# EAGLE design core (EAGLE 6.3)
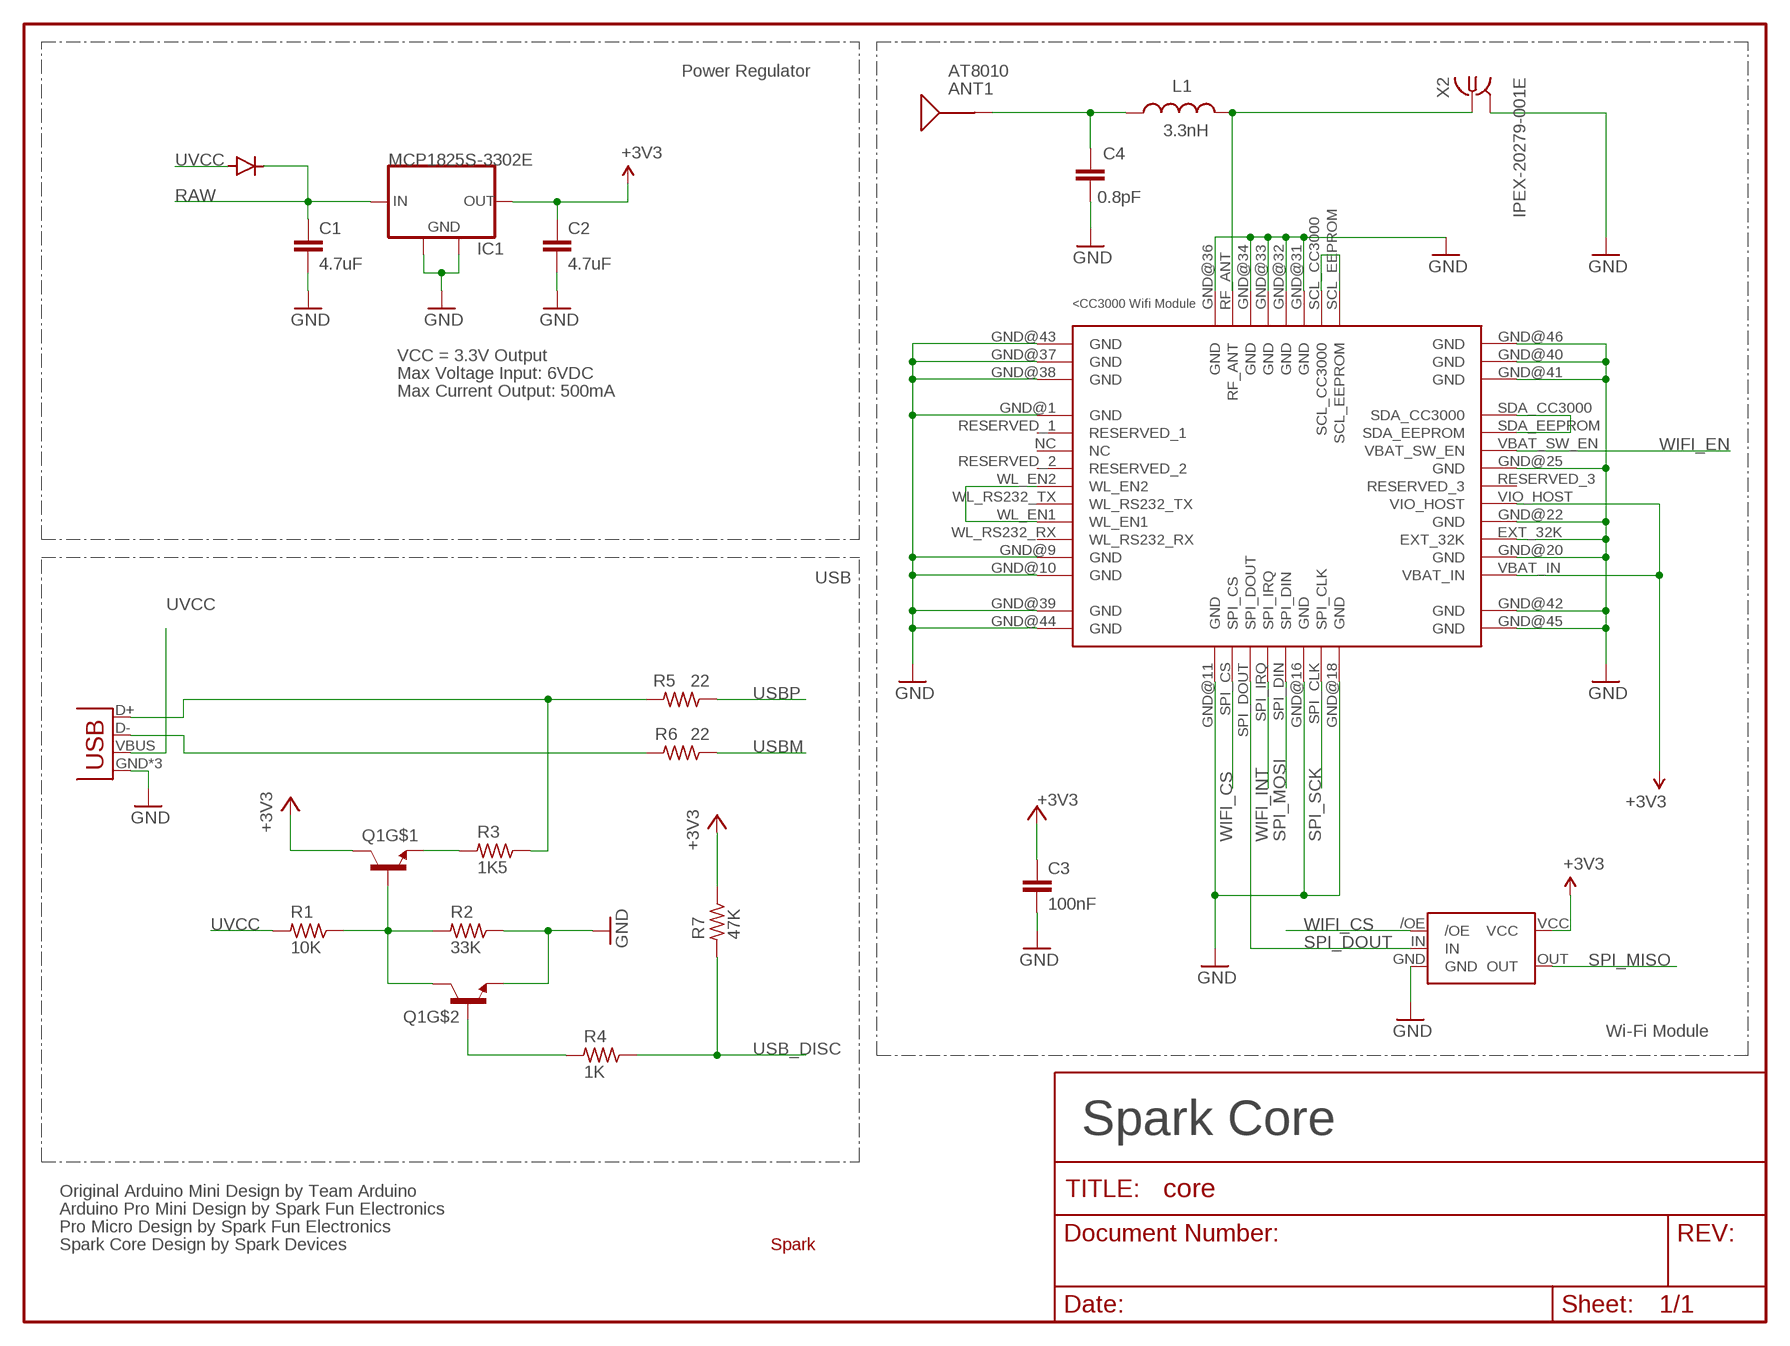
[diagram p0: schematic, sheet 1, part 1 of 2]
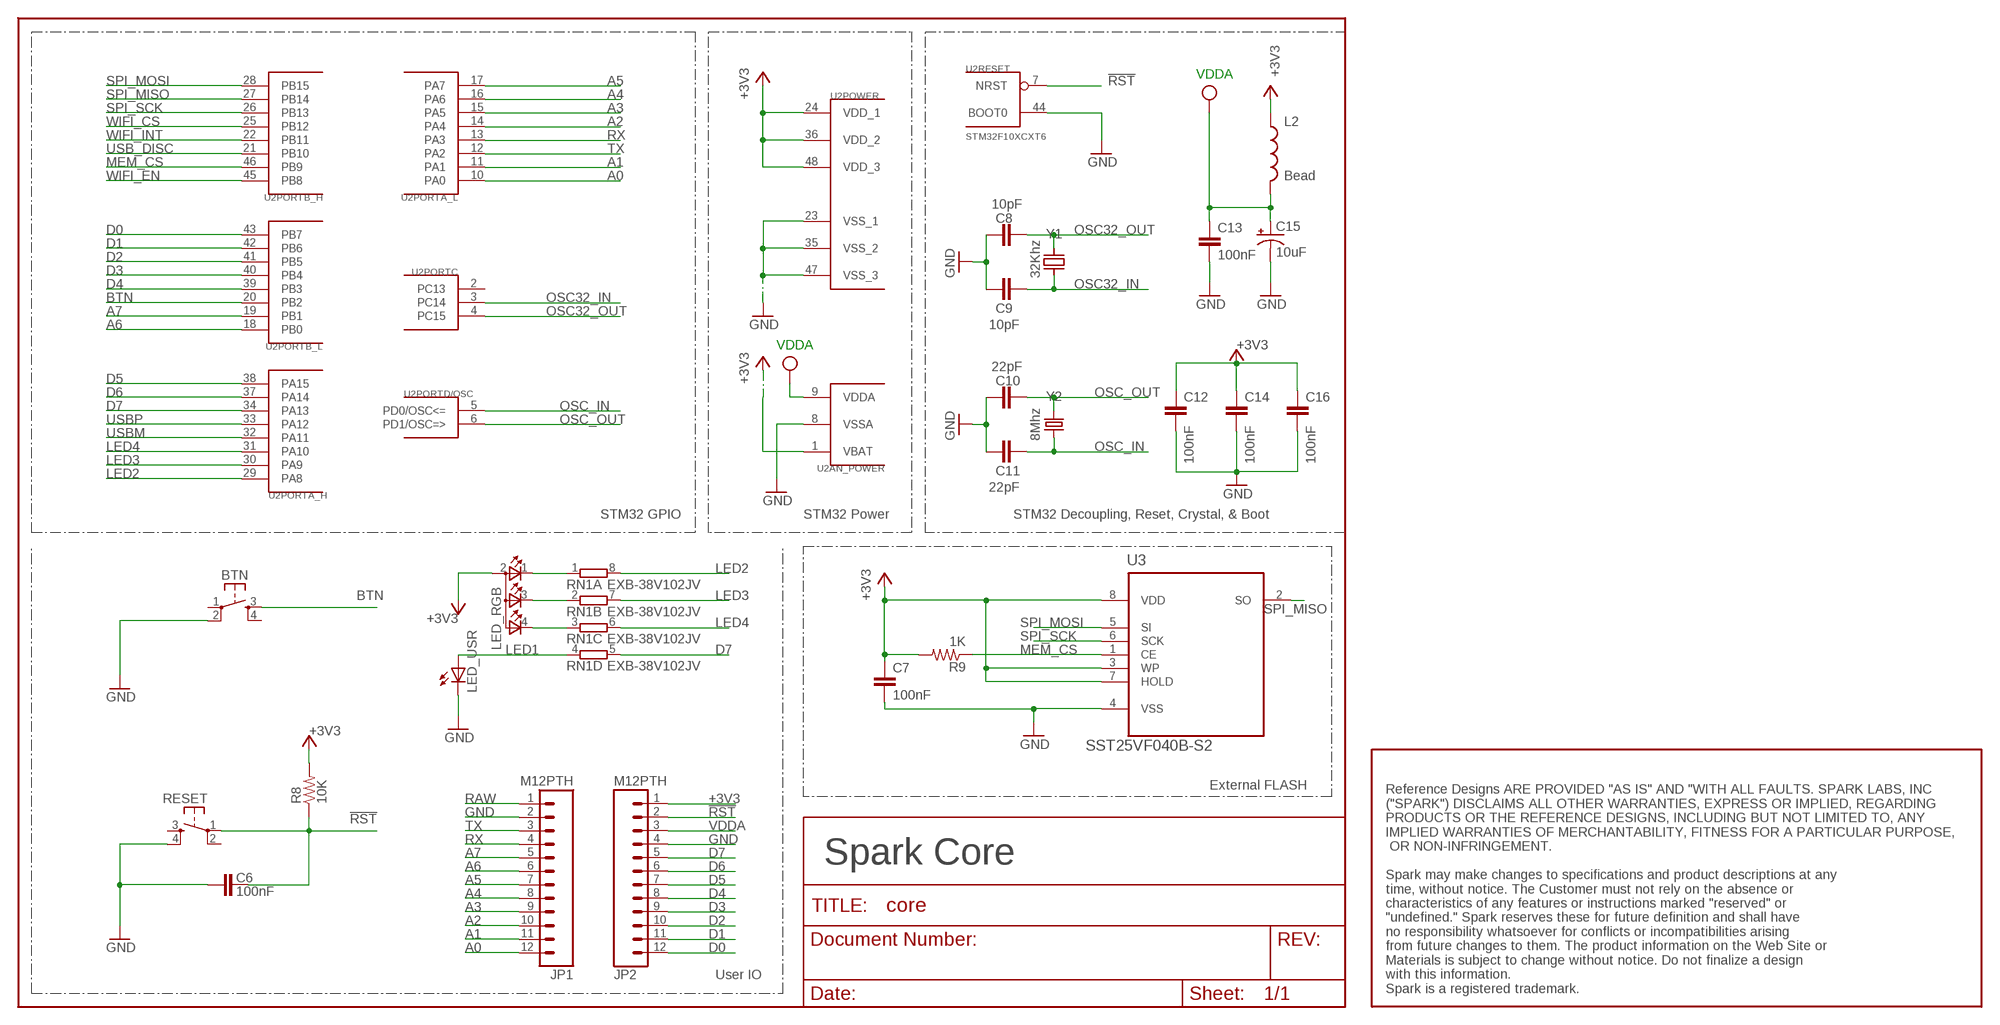
[diagram p1: schematic, sheet 1, part 2 of 2]

## Parts
ANT1  AT8010  [AT8010]
BTN  KMR211GLFS  TAC_SWITCHSMD  [TACTILE_SWITCH_SMD]
C1  4.7uF  C-EUC0603  [C0603]
C2  4.7uF  C-EUC0603  [C0603]
C3  100nF  C-EUC0603  [C0603]
C4  0.8pF  C-EUC0603  [C0603]
C6  100nF  C-EUC0603  [C0603]
C7  100nF  C-EUC0603  [C0603]
C8  10pF  C-EUC0603  [C0603]
C9  10pF  C-EUC0603  [C0603]
C10  22pF  C-EUC0603  [C0603]
C11  22pF  C-EUC0603  [C0603]
C12  100nF  C-EUC0603  [C0603]
C13  100nF  C-EUC0603  [C0603]
C14  100nF  C-EUC0603  [C0603]
C15  10uF  TANT-CAP1206  [EIA3216]
C16  100nF  C-EUC0603  [C0603]
D1  DIODE  [DIODE-DO-220AA(SMP)]
IC1  MCP1825S-3302E  MCP1825S-SOT223  [SOT223]
JP1  M12PTH  [1X12-SMALL-PADS]
JP2  M12PTH  [1X12-SMALL-PADS]
L1  3.3nH  INDUCTOR0603  [0603]
L2  Bead  INDUCTOR0603  [0603]
LED_RGB  TOPLED-3PLCC  [P-LCC-4-3]
LED_USR  LED0603  [LED-0603]
Q1  MMDT3904  [SOT363]
R1  10K  R-US_R0603  [R0603]
R2  33K  R-US_R0603  [R0603]
R3  1K5  R-US_R0603  [R0603]
R4  1K  R-US_R0603  [R0603]
R5  22  R-US_R0603  [R0603]
R6  22  R-US_R0603  [R0603]
R7  47K  R-US_R0603  [R0603]
R8  10K  R-US_R0603  [R0603]
R9  1K  R-US_R0603  [R0603]
RESET  KMR211GLFS  TAC_SWITCHSMD  [TACTILE_SWITCH_SMD]
RN1  EXB-38V102JV  4R-NEXB38V  [EXB38V]
U1  CC3000  [CC3000]
U2  STM32F10XCXT6  [TQFP48]
U3  SST25VF040B-S2  [SOIC127P790X216-8N]
U4  NL17SZ125SOT553  [SOT-553]
U$1  SPARK_LOGO2  [SPARK_LOGO2]
X1  USB-MICROB  USBUSB-MICROB-SLOT-HOLE  [USB-MICROB-SLOT-HOLE]
X2  IPEX-20279-001E  [IPEX-20279-001E]
Y1  32Khz  Q_FC135  [FC135]
Y2  8Mhz  CRYSTAL5X3  [CRYSTAL-SMD-5X3]

## Nets
!RST: C6.2 JP2.2 R8.1 RESET.1 U2.7(RESET:NRST)
+3V3: C2.1 C3.1 C7.1 C12.1 C14.1 C16.1 IC1.3(OUT) JP2.1 L2.1 LED_RGB.2(A2) Q1.3(C) R7.1 R8.2 R9.2 U1.VBAT_IN U1.VIO_HOST U2.1(AN_POWER:VBAT) U2.24(POWER:VDD_1) U2.36(POWER:VDD_2) U2.48(POWER:VDD_3) U3.3(WP) U3.7(HOLD) U3.8(VDD) U4.VCC
A0: JP1.12 U2.10(PORTA_L:PA0)
A1: JP1.11 U2.11(PORTA_L:PA1)
A2: JP1.10 U2.14(PORTA_L:PA4)
A3: JP1.9 U2.15(PORTA_L:PA5)
A4: JP1.8 U2.16(PORTA_L:PA6)
A5: JP1.7 U2.17(PORTA_L:PA7)
A6: JP1.6 U2.18(PORTB_L:PB0)
A7: JP1.5 U2.19(PORTB_L:PB1)
BTN: BTN.3 U2.20(PORTB_L:PB2)
D0: JP2.12 U2.43(PORTB_L:PB7)
D1: JP2.11 U2.42(PORTB_L:PB6)
D2: JP2.10 U2.41(PORTB_L:PB5)
D3: JP2.9 U2.40(PORTB_L:PB4)
D4: JP2.8 U2.39(PORTB_L:PB3)
D5: JP2.7 U2.38(PORTA_H:PA15)
D6: JP2.6 U2.37(PORTA_H:PA14)
D7: JP2.5 RN1.5 U2.34(PORTA_H:PA13)
GND [vcc]: BTN.2 C1.2 C2.2 C3.2 C4.2 C6.1 C7.2 C8.2 C9.2 C10.2 C11.2 C12.2 C13.2 C14.2 C15.C(-) C16.2 IC1.2(GND) IC1.4(GND) JP1.2 JP2.4 LED_USR.C Q1.1(E) R2.1 RESET.4 U1.EXT_32K U1.GND@1(GND) U1.GND@9(GND) U1.GND@10(GND) U1.GND@11(GND) U1.GND@16(GND) U1.GND@18(GND) U1.GND@20(GND) U1.GND@22(GND) U1.GND@25(GND) U1.GND@31(GND) U1.GND@32(GND) U1.GND@33(GND) U1.GND@34(GND) U1.GND@36(GND) U1.GND@37(GND) U1.GND@38(GND) U1.GND@39(GND) U1.GND@40(GND) U1.GND@41(GND) U1.GND@42(GND) U1.GND@43(GND) U1.GND@44(GND) U1.GND@45(GND) U1.GND@46(GND) U2.8(AN_POWER:VSSA) U2.23(POWER:VSS_1) U2.35(POWER:VSS_2) U2.44(RESET:BOOT0) U2.47(POWER:VSS_3) U3.4(VSS) U4.GND X1.GND X1.MT1(GND) X1.MT2(GND) X2.2@1(GND) X2.2@2(GND)
LED1: LED_USR.A RN1.4
LED2: RN1.8 U2.29(PORTA_H:PA8)
LED3: RN1.7 U2.30(PORTA_H:PA9)
LED4: RN1.6 U2.31(PORTA_H:PA10)
MEM_CS: R9.1 U2.46(PORTB_H:PB9) U3.1(CE)
N$1: R3.1 R5.2 X1.D+
N$2 [RF]: L1.2 U1.RF_ANT X2.1
N$3 [RF]: ANT1.SIG(SIGNAL) C4.1 L1.1
N$6: R6.2 X1.D-
N$7: U1.SCL_CC3000 U1.SCL_EEPROM
N$8: Q1.2(B) R4.2
N$9: U1.WL_EN1 U1.WL_EN2
N$10: LED_RGB.1(CRED) RN1.1
N$12: LED_RGB.3(CBLUE) RN1.2
N$13: Q1.5(B) Q1.6(C) R1.1 R2.2
N$14: LED_RGB.4(CGREEN) RN1.3
N$15: U1.SDA_CC3000 U1.SDA_EEPROM
N$16: Q1.4(E) R3.2
OSC32_IN: C9.1 U2.3(PORTC:PC14) Y1.X1
OSC32_OUT: C8.1 U2.4(PORTC:PC15) Y1.X2
OSC_IN: C11.1 U2.5(PORTD/OSC:PD0/OSC<=) Y2.1
OSC_OUT: C10.1 U2.6(PORTD/OSC:PD1/OSC=>) Y2.3
RAW [vcc]: C1.1 D1.CATHODE IC1.1(IN) JP1.1
RX: JP1.4 U2.13(PORTA_L:PA3)
SPI_DOUT: U1.SPI_DOUT U4.IN
SPI_MISO: U2.27(PORTB_H:PB14) U3.2(SO) U4.OUT
SPI_MOSI: U1.SPI_DIN U2.28(PORTB_H:PB15) U3.5(SI)
SPI_SCK: U1.SPI_CLK U2.26(PORTB_H:PB13) U3.6(SCK)
TX: JP1.3 U2.12(PORTA_L:PA2)
USB_DISC: R4.1 R7.2 U2.21(PORTB_H:PB10)
USBM: R6.1 U2.32(PORTA_H:PA11)
USBP: R5.1 U2.33(PORTA_H:PA12)
UVCC: D1.ANODE R1.2 X1.VBUS
VDDA: C13.1 C15.A(+) JP2.3 L2.2 U2.9(AN_POWER:VDDA) ; supply symbol labelled VCC
WIFI_CS: U1.SPI_CS U2.25(PORTB_H:PB12) U4./OE
WIFI_EN: U1.VBAT_SW_EN U2.45(PORTB_H:PB8)
WIFI_INT: U1.SPI_IRQ U2.22(PORTB_H:PB11)
Unconnected: BTN.1 BTN.4 RESET.2 RESET.3 U1.NC U1.RESERVED_1 U1.RESERVED_2 U1.RESERVED_3 U1.WL_RS232_RX U1.WL_RS232_TX U2.2(PORTC:PC13)

## Notes on the sheet
- Power Regulator
- VDDA
- VCC = 3.3V Output
- Max Voltage Input: 6VDC
- Max Current Output: 500mA
- VDDA
- USB
- STM32 GPIO | STM32 Power | STM32 Decoupling, Reset, Crystal, & Boot
- Wi-Fi Module | External FLASH
- Spark Core | Spark Core
- Original Arduino Mini Design by Team Arduino
- Arduino Pro Mini Design by Spark Fun Electronics
- Pro Micro Design by Spark Fun Electronics
- Spark Core Design by Spark Devices
- User IO
- Reference Designs ARE PROVIDED "AS IS" AND "WITH ALL FAULTS. SPARK LABS, INC 
  ("SPARK") DISCLAIMS ALL OTHER WARRANTIES, EXPRESS OR IMPLIED, REGARDING 
  PRODUCTS OR THE REFERENCE DESIGNS, INCLUDING BUT NOT LIMITED TO, ANY 
  IMPLIED WARRANTIES OF MERCHANTABILITY, FITNESS FOR A PARTICULAR PURPOSE,
   OR NON-INFRINGEMENT.
  
  Spark may make changes to specifications and product descriptions at any 
  time, without notice. The Customer must not rely on the absence or 
  characteristics of any features or instructions marked "reserved" or 
  "undefined." Spark reserves these for future definition and shall have 
  no responsibility whatsoever for conflicts or incompatibilities arising 
  from future changes to them. The product information on the Web Site or 
  Materials is subject to change without notice. Do not finalize a design 
  with this information. 
  Spark is a registered trademark.

## Library data of the parts
ANT1 = Spark:AT8010: AT8010 Series Multilayer Chip Antenna
BTN RESET = Spark:TAC_SWITCH: SMD Tactiile Switch
C1-C4 C6-C14 C16 = rcl:C-EU: CAPACITOR, European symbol
C15 = Spark:TANT-CAP: Tantalum SMT
D1 = Spark:DIODE
IC1 = Spark:MCP1825S: 500 mA, Low Voltage, Low Quiescent Current LDO Regulator
JP1 JP2 = Spark:M12: Header 12 Standard 12-pin 0.1" header. Use with straight break away headers (SKU : PRT-00116), right angle break away headers (PRT-00553), swiss pins (PRT-00743), machine pins (PRT-00117), and female headers (PRT-00115).
L1 L2 = SparkFun-Passives:INDUCTOR: Inductors Basic Inductor/Choke - 0603 and 1206. Footprints are not proven and vary greatly between part numbers.
LED_RGB = Spark:TOPLED-3: Cree CLVBA-FKA
LED_USR = SparkFun:LED: LEDs Standard schematic elements and footprints for 5mm, 3mm, 1206, and 0603 sized LEDs. 5mm - Spark Fun Electronics SKU : COM-00529 (and others)
Q1 = SparkFun-DiscreteSemi:MMDT3904: Dual NPN transistor
R1-R9 = rcl:R-US_: RESISTOR, American symbol
RN1 = resistor-dil:4R-N: Array Chip Resistor Source: RS Component / Phycomp; OC_FARNELL: unknown; OC_NEWARK: unknown
U1 = CC3000:CC3000
U2 = stm32:STM32F10XCXT6: ST STM32F101/103 48pin LQFP
U3 = Spark:SST25VF040B: 4 Mbit SPI Serial Flash
U4 = Spark:NL17SZ125
U$1 = Spark:SPARK_LOGO2
X1 = Spark:USB
X2 = Spark:IPEX-20279-001E: Ultra Miniature Coaxial SMT RF Receptacle
Y1 = Spark:Q
Y2 = SparkFun-FreqCtrl:CRYSTAL: Various standard crystals. Proven footprints. Spark Fun Electronics SKU : COM-00534

## Net classes
2 RF: width 0.635 mm, clearance 0.762 mm

## Board
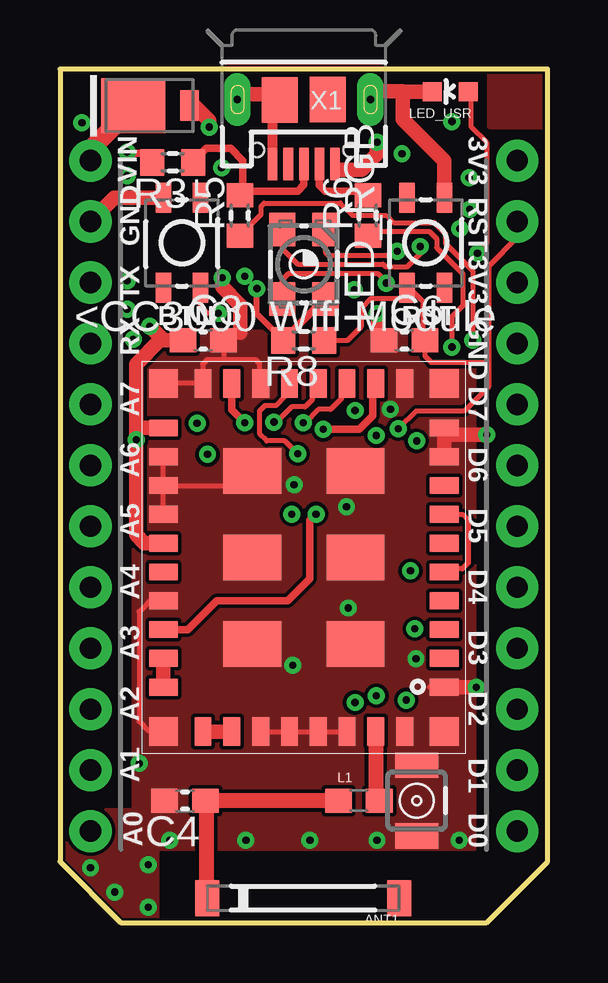
[diagram p2: board, top side]
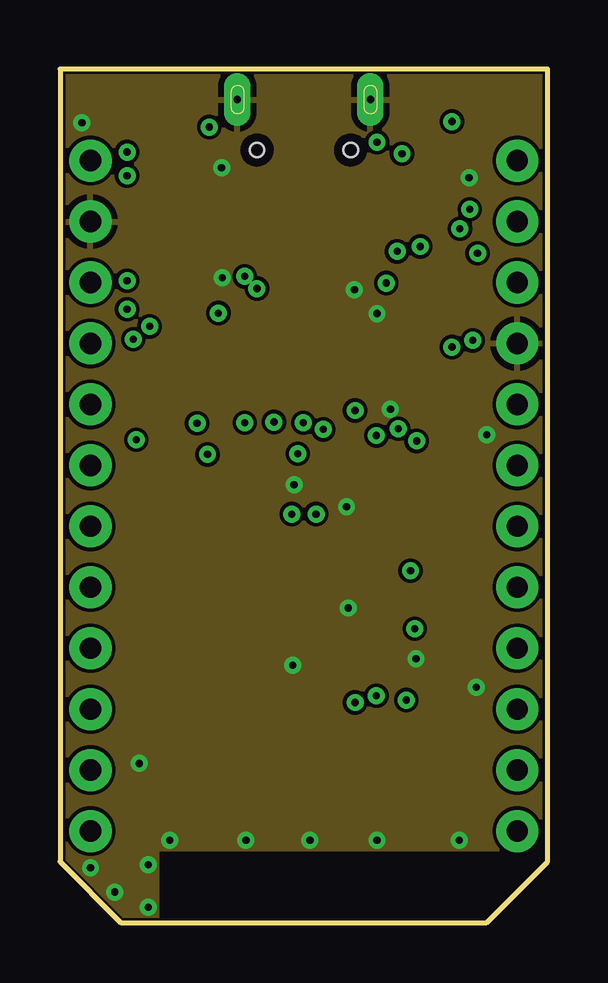
[diagram p3: board, inner layer $GND]
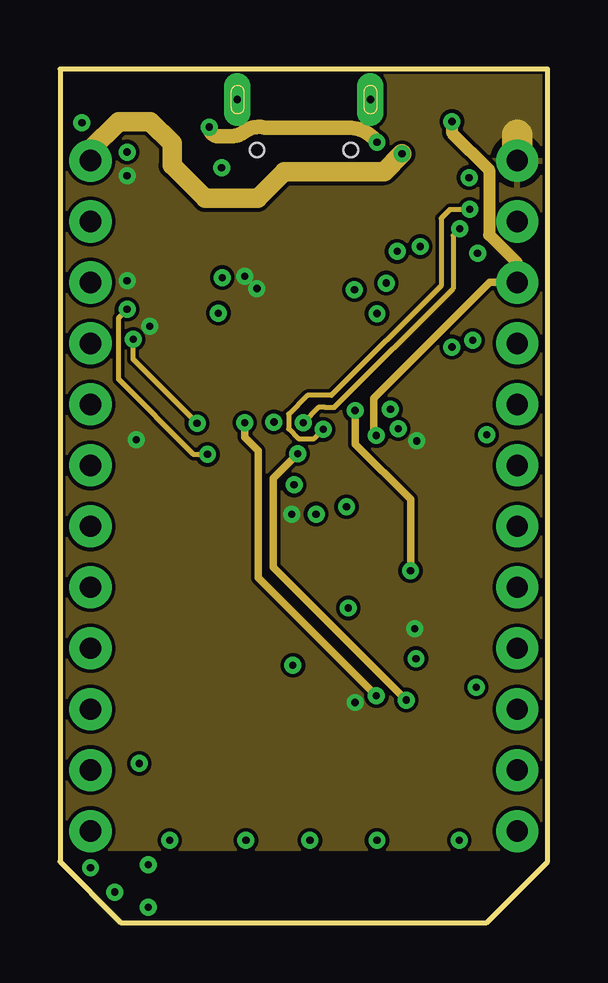
[diagram p4: board, inner layer $+3V3]
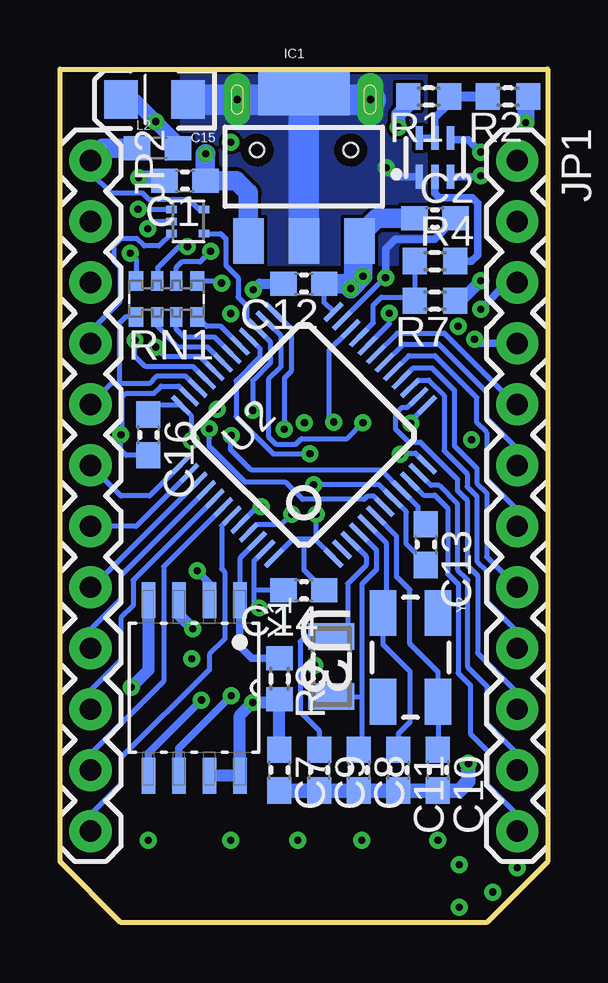
[diagram p5: board, bottom side, seen from below]

Size 20.32 x 35.56 mm. Coordinates in mm from the lower left corner, seen from the top.
Outline: 0,35.56 0,2.54 2.54,0 17.78,0 20.32,2.54 20.32,35.56 0,35.56
Copper layers (1+2*15+16): Top 0.035mm / dielectric 1.5mm / $GND 0.035mm / dielectric 0.15mm / $+3V3 0.035mm / dielectric 0.2mm / Bottom 0.035mm
Design rules "spark *": minimum track width 6mil, minimum drill 0.3mm, track to track 6mil, track to pad 6mil, pad to pad 6mil, via to via 6mil, smd to smd 6mil, copper to edge 4mil, drill to drill 6mil, minimum pad ring 12mil, minimum via ring 8mil, stop-mask expansion 4mil, vias tented up to drill 20mil, thermal gap 10mil

### Footprints (pad centres in the part's own frame; a part is rotated, then mirrored left to right if it is on the bottom)
AT8010 = smd 1 x 1.5: NC -4,0; SIG 4,0
TACTILE_SWITCH_SMD = smd 1.25 x 0.65: 1 -1.875,0.775; 2 1.875,0.775; 3 -1.875,-0.775; 4 1.875,-0.775
C0603 = smd 1.1 x 1: 1 -0.85,0; 2 0.85,0
EIA3216 = smd 1.4 x 1.6: A 1.4,0; C -1.4,0
DIODE-DO-220AA(SMP) = smd 0.762 x 1.27: ANODE 2.349,0 | smd 2.667 x 2.286: CATHODE 0,0
SOT223 = smd 1.27 x 1.905: 1 -2.311,-3.099; 2 0,-3.099; 3 2.311,-3.099 | smd 3.81 x 1.905: 4 0,3.099
1X12-SMALL-PADS = drill 0.889 pad 1.753: 1 0,0; 2 2.54,0; 3 5.08,0; 4 7.62,0; 5 10.16,0; 6 12.7,0; 7 15.24,0; 8 17.78,0; 9 20.32,0; 10 22.86,0; 11 25.4,0; 12 27.94,0
0603 = smd 1.1 x 1: 1 -0.85,0; 2 0.85,0
P-LCC-4-3 = smd 1.1 x 1.4: 1 -0.9,-1.45; 2 0.9,-1.45; 3 0.9,1.45; 4 -0.9,1.45
LED-0603 = smd 0.8 x 0.8: A 0,-0.75; C 0,0.75
SOT363 = smd 0.3 x 0.99: 1 -0.65,-0.8; 2 0,-0.8; 3 0.65,-0.8; 4 0.65,0.81; 5 0,0.81; 6 -0.65,0.81
R0603 = smd 1 x 1.1: 1 -0.85,0; 2 0.85,0
EXB38V = smd 0.6 x 0.8: 1 -1.275,-0.75; 4 1.275,-0.75; 5 1.275,0.75; 8 -1.275,0.75 | smd 0.5 x 0.8: 2 -0.4,-0.75; 3 0.4,-0.75; 6 0.4,0.75; 7 -0.4,0.75
CC3000 = smd 1.2 x 0.7: EXT_32K 5.85,-2.97; GND@1 -5.85,5.43; GND@9 -5.85,-4.17; GND@10 -5.85,-5.37; GND@20 5.85,-4.17; GND@22 5.85,-1.77; GND@25 5.85,1.83; NC -5.85,3.03; RESERVED_1 -5.85,4.23; RESERVED_2 -5.85,1.83; RESERVED_3 5.85,0.63; SDA_CC3000 5.85,5.43; SDA_EEPROM 5.85,4.23; VBAT_IN 5.85,-5.37; VBAT_SW_EN 5.85,3.03; VIO_HOST 5.85,-0.57; WL_EN1 -5.85,-1.77; WL_EN2 -5.85,0.63; WL_RS232_RX -5.85,-2.97; WL_RS232_TX -5.85,-0.57 | smd 0.7 x 1.2: GND@11 -4.2,-7.22; GND@16 1.8,-7.22; GND@18 4.2,-7.22; GND@31 1.8,7.28; GND@32 0.6,7.28; GND@33 -0.6,7.28; GND@34 -1.8,7.28; GND@36 -4.2,7.28; RF_ANT -3,7.28; SCL_CC3000 3,7.28; SCL_EEPROM 4.2,7.28; SPI_CLK 3,-7.22; SPI_CS -3,-7.22; SPI_DIN 0.6,-7.22; SPI_DOUT -1.8,-7.22; SPI_IRQ -0.6,-7.22 | smd 2.4 x 1.9: GND@37 -2.15,3.63; GND@38 -2.15,0.03; GND@39 -2.15,-3.57; GND@40 2.15,3.63; GND@41 2.15,0.03; GND@42 2.15,-3.57 | smd 1.2 x 1.2: GND@43 -5.85,7.28; GND@44 -5.85,-7.22; GND@45 5.85,-7.22; GND@46 5.85,7.28
TQFP48 = smd 0.2 x 1: 1 -2.75,-4.5; 2 -2.25,-4.5; 3 -1.75,-4.5; 4 -1.25,-4.5; 5 -0.75,-4.5; 6 -0.25,-4.5; 7 0.25,-4.5; 8 0.75,-4.5; 9 1.25,-4.5; 10 1.75,-4.5; 11 2.25,-4.5; 12 2.75,-4.5; 25 2.75,4.5; 26 2.25,4.5; 27 1.75,4.5; 28 1.25,4.5; 29 0.75,4.5; 30 0.25,4.5; 31 -0.25,4.5; 32 -0.75,4.5; 33 -1.25,4.5; 34 -1.75,4.5; 35 -2.25,4.5; 36 -2.75,4.5 | smd 1 x 0.2: 13 4.5,-2.75; 14 4.5,-2.25; 15 4.5,-1.75; 16 4.5,-1.25; 17 4.5,-0.75; 18 4.5,-0.25; 19 4.5,0.25; 20 4.5,0.75; 21 4.5,1.25; 22 4.5,1.75; 23 4.5,2.25; 24 4.5,2.75; 37 -4.5,2.75; 38 -4.5,2.25; 39 -4.5,1.75; 40 -4.5,1.25; 41 -4.5,0.75; 42 -4.5,0.25; 43 -4.5,-0.25; 44 -4.5,-0.75; 45 -4.5,-1.25; 46 -4.5,-1.75; 47 -4.5,-2.25; 48 -4.5,-2.75
SOIC127P790X216-8N = smd 1.499 x 0.559: 1 -3.658,1.905; 2 -3.658,0.635; 3 -3.658,-0.635; 4 -3.658,-1.905; 5 3.658,-1.905; 6 3.658,-0.635; 7 3.658,0.635; 8 3.658,1.905
SOT-553 = smd 0.3 x 0.45: /OE -0.5,0; GND 0.5,0; IN 0,0; OUT 0.5,1.35; VCC -0.5,1.35
USB-MICROB-SLOT-HOLE = smd 0.4 x 1.35: D+ 0,2.675; D- -0.65,2.675; GND 1.3,2.675; ID 0.65,2.675; VBUS -1.3,2.675 | drill 0.3 pad 1.1 long: MT1 -2.775,0; MT2 2.775,0 | smd 1.5 x 1.9: P$1 -1,0; P$2 1,0.01 | hole 0.6: -1.95,2.1; 1.95,2.1
IPEX-20279-001E = smd 1 x 1.05: 1 0,1.528 | smd 1.05 x 1.8: 2@1 -1.475,0; 2@2 1.475,0
FC135 = smd 1.1 x 1.9: X1 -1.25,0; X2 1.25,0
CRYSTAL-SMD-5X3 = smd 1.9 x 1.1: 1 -1.85,-1.15; 2 1.85,-1.15; 3 1.85,1.15; 4 -1.85,1.15

### Placement (x,y rotation side)
ANT1  10.13,1.02 180 top
BTN  5.08,28.32 90 top
C1  15.11,30.91 180 bottom
C2  4.7,29.34 0 bottom
C3  5.97,24.26 0 top
C4  5.21,5.08 180 top
C6  14.35,24.26 0 top
C7  11.18,6.35 270 bottom
C8  7.87,6.35 270 bottom
C9  9.53,6.35 270 bottom
C10  4.57,6.35 270 bottom
C11  6.22,6.35 270 bottom
C12  10.16,26.62 180 bottom
C13  5.08,15.75 270 bottom
C14  10.16,13.84 180 bottom
C15  16.38,34.29 180 bottom
C16  16.64,20.32 270 bottom
D1  3.05,34.04 0 top
IC1  10.16,31.5 0 bottom
JP1  1.27,31.75 270 bottom
JP2  19.05,31.75 270 bottom
L1  12.45,5.08 0 top
L2  16.26,32.26 0 bottom
LED_RGB  10.16,27.43 0 top
LED_USR  16.26,34.62 90 top
Q1  4.7,31.88 0 bottom
R1  4.95,34.42 180 bottom
R2  1.65,34.42 180 bottom
R3  4.7,31.67 180 top
R4  4.7,27.56 0 bottom
R5  7.49,29.46 90 top
R6  12.83,29.46 90 top
R7  4.7,25.91 180 bottom
R8  10.16,24.26 180 top
R9  11.18,10.16 270 bottom
RESET  15.24,28.32 90 top
RN1  15.88,25.98 180 bottom
U1  10.16,15.24 180 top
U2  10.16,20.32 45 bottom
U3  14.73,9.78 270 bottom
U4  15.67,29.21 270 bottom
U$1  17.78,33.02 0 top
X1  10.16,34.29 180 top
X2  14.86,5.08 90 top
Y1  9.02,10.67 270 bottom
Y2  5.71,11.05 270 bottom

### Tracks (layer width: path | path; a pad name or v marks a point on that pad's centre or on a via)
!RST  (via drill 0.3)
  Top 0.203: R8.1 11.99,24.26 12.55,24.82 12.55,25.6 12.95,26.01 14.46,26.01 RESET.1 14.55,26.45 15.14,25.86 15.14,24.32 C6.2 15.2,23.61 15.47,23.34 17.86,23.34 | v14.1,20.57 14.83,21.31 16.84,21.31 17.86,22.33 17.86,23.34 | JP2.2 19.05,28.55 17.86,27.36 17.86,23.34
  Bottom 0.203: 14.1,20.17 v14.1,20.57 14.1,19.84 12.6,18.34 10.92,18.34 10.21,17.63 7.64,17.63 7.49,17.78 7.27,17.78 U2.7
+3V3  (via drill 0.3)
  Top 0.254: R8.2 8.2,25.36 v8.2,26.42
  Top 0.305: R8.2 11.04,25.98 LED_RGB.2
  Top 0.61: U1.VIO_HOST 3.52,15.81 3.17,16.15 v3.17,20.12 3.17,20.62 | 3.17,20.62 3.17,23.27 4.17,24.26 4.32,24.26 | 4.32,24.26 C3.1 | U1.VBAT_IN 4.29,20.62 3.17,20.62 | v3.73,24.84 4.32,24.26
  $+3V3 1.27: JP2.1 19.05,32.82
  Bottom 0.203: U2.1 9.71,15.98 | 9.71,15.98 10.16,15.98 | 10.16,15.98 10.62,15.98 U2.48 | 10.16,15.98 10.16,14.69 C14.1 | C16.1 16.25,21.56 U2.36 14.86,21.13 v14.86,20.07 | 9.71,15.98 9.65,16.03 v9.65,17.02 | JP2.1 19.05,31.24 18.19,30.38 16.87,30.38 16.61,30.12 14.94,30.12 14.52,29.71 U4.VCC | U2.24 9.31,25.83 C12.1
  Bottom 0.305: Q1.3 2.83,31.08 arc-90 v2.79,31.11
  Bottom 0.508: U3.7 U3.8 12.83,8.64 v12.29,9.17 11.32,9.17 R9.2 C7.1 | v14.78,12.24 15.37,12.83 U3.3 | v2.79,26.75 3.63,25.91 R7.1
  Bottom 0.813: C2.1 7.11,29.34 7.85,28.6 IC1.3 7.85,27.08 v7.7,26.92 | L2.1 18.54,32.26 JP2.1 | v8.2,26.42 v7.7,26.92 | v7.7,26.92 7.7,28.83 8.08,28.45 8.08,26.62 C12.1
  pour $+3V3: 0,35.56 20.32,35.56 20.32,3.05 0,3.05
A0
  Bottom 0.203: U2.10 5.17,17.8 4.7,17.8 4.17,17.27 4.17,14.53 3.73,14.1 3.73,10.39 3.23,9.88 3.23,7.87 2.52,7.16 2.52,5.74 1.27,4.5 JP1.12
A1
  Bottom 0.203: U2.11 4.87,18.21 4.52,18.21 3.76,17.45 3.76,14.71 3.33,14.28 3.33,10.64 2.52,9.83 2.52,8.28 1.27,7.04 JP1.11
A2
  Bottom 0.203: JP1.10 1.27,9.58 2.92,11.23 2.92,14.45 3.35,14.88 3.35,17.6 3.76,18.01 3.76,18.47 5.31,20.02 5.79,20.02 6.35,20.57 6.35,21.18 6.07,21.46 5.84,21.46 U2.14
A3
  Bottom 0.203: U2.15 5.4,22.61 4.95,22.61 4.32,21.97 4.32,19.66 3.35,18.69 3.35,18.16 2.95,17.75 2.95,15.06 2.52,14.63 2.52,13.36 1.27,12.12 JP1.9
A4
  Bottom 0.203: U2.16 5.6,23.11 4.83,23.11 3.89,22.17 3.89,19.86 2.95,18.92 2.95,18.31 2.54,17.91 2.54,15.24 JP1.8
A5
  Bottom 0.203: U2.17 5.8,23.62 4.7,23.62 2.95,21.87 2.95,20.83 2.54,20.42 2.54,18.47 1.27,17.2 JP1.7
A6
  Bottom 0.203: U2.18 6.02,24.11 4.55,24.11 2.54,22.1 2.54,21.01 1.27,19.74 JP1.6
A7
  Bottom 0.203: U2.19 6.27,24.56 4.32,24.56 1.35,21.59 JP1.5
BTN  (via drill 0.3)
  Top 0.203: 5.84,26.43 BTN.3 5.87,26.43 5.87,25.65 6.13,25.39 v6.6,25.39
  Bottom 0.203: U2.20 6.6,24.94 v6.6,25.39
D0
  Bottom 0.203: JP2.12 19.05,4.5 17.78,5.77 17.78,6.86 14.1,10.54 14.1,11.18 13.46,11.81 13.46,14.61 13.59,14.73 13.59,16.54 U2.43
D1
  Bottom 0.203: U2.42 16,14.83 16,10.06 19.05,7.01 JP2.11
D2
  Bottom 0.203: U2.41 17.27,14.27 17.27,13.21 17.78,12.7 17.78,10.92 19.05,9.65 JP2.10
D3
  Bottom 0.203: U2.40 17.77,14.48 17.78,14.48 17.78,13.46 19.05,12.19 JP2.9
D4
  Bottom 0.203: U2.39 18.98,13.97 JP2.8
D5
  Bottom 0.203: U2.38 17.15,16.51 JP2.7
D6
  Bottom 0.203: U2.37 16.59,17.78 17.78,17.78 JP2.6
D7
  Bottom 0.203: 17.88,22.45 16.61,22.45 16.31,22.76 15.07,22.76 U2.34 | 17.88,22.45 18.19,22.45 JP2.5 | RN1.5 17.59,25.23 17.86,24.97 17.86,22.48 17.88,22.45
GND  (via drill 0.3)
  Top 0.203: U1.GND@43 16.01,8.12 | U1.GND@1 15.4,9.81 | U1.GND@34 U1.GND@33 U1.GND@32 U1.GND@31 8.36,8.4 | U1.GND@22 U1.EXT_32K | U1.GND@38 12.41,15.11 | U1.GND@25 4.49,13.59 3.94,13.59 3.3,12.95 3.3,8.38 3.68,8 4.27,8 U1.GND@46 | U1.EXT_32K U1.GND@20 | U1.EXT_32K 7.41,18.21 U1.GND@42 | 6.83,23.47 6.15,23.47 5.94,23.27 5.94,22.48 | 6.83,23.47 8.13,23.47 8.31,23.29 8.31,22.51 U1.GND@16 8.26,22.36 8.26,21.97 | C3.2 6.82,23.48 6.83,23.47 | U1.GND@18 5.94,22.48 | 5.94,22.48 4.33,22.48 U1.GND@45
  Top 0.406: X1.GND 8.86,34.51
  Top 0.508: v13.21,25.38 13.21,24.55 C6.1
  Top 0.61: U1.GND@1 v17.34,9.81 v17.35,9.8 | v6.76,26.87 6.76,26.49 7.52,25.73 7.52,24.57 | U1.GND@9 U1.GND@10 16.3,20.32 v17.78,20.32 | BTN.2 2.26,30.2 JP1.2 | 8.86,34.51 7.61,34.51 X1.MT2 | 14.28,34.65 13.29,34.65 X1.MT1 | RESET.4 16.02,31.74 14.28,33.48 14.28,34.65 | LED_USR.C 14.3,34.62 14.28,34.65
  $GND 0.406: X1.MT2 7.38,34.85 7.39,34.85 7.39,34.67 | X1.MT1 12.93,34.31 | 12.93,34.85 12.93,34.7
  $GND 1.016: 7.39,34.85 7.39,34.67 7.39,33.73 | 12.93,34.85 12.93,34.7 12.93,34.31 12.93,33.73
  $+3V3 0.406: 7.39,34.7 7.38,34.7 X1.MT2 | 12.93,34.7 12.94,34.7 X1.MT1
  $+3V3 0.813: 7.39,33.91 7.39,34.7 | 12.93,33.91 12.93,34.7
  Bottom 0.203: U2.35 15.37,22.35 16.1,22.35 16.41,22.05 17.58,22.05 17.73,21.89 17.73,20.37 v17.78,20.32 17.78,19.68 17.57,19.47 C16.2 | U2.47 12.24,15.05 12.24,13.84 | C13.2 5.08,14.96 5.89,15.77 5.89,17.11 U2.8 7.02,18.24 v9.75,18.24 | U4.GND 16.19,28.19 16.82,28.19 17.12,28.5 17.78,28.5 18.09,28.19 18.09,27.58 17.83,27.33 17.83,25.86 19.05,24.64 JP2.4 | U2.44 12.1,17.32 v11.94,17.32 | 12.24,13.84 12.24,13.34 v12.01,13.11 | C14.2 12.24,13.84 | U2.23 6.79,26.87 v6.76,26.87
  Bottom 0.305: 10.16,34.67 IC1.4 | Q1.1 6.36,31.08 v6.73,31.45 | C2.2 4.71,28.47 6.35,28.47 6.76,28.07 v6.76,26.87
  Bottom 0.406: v12.27,26.36 12.01,26.62 C12.2 | X1.MT2 7.37,34.29
  Bottom 0.508: U3.4 16.64,10.52 v17.35,9.8
  Bottom 0.61: C7.2 C9.2 C8.2 C11.2 C10.2 3.69,5.5 3.3,5.89 v3.3,6.63 | C1.2 16.09,31.04 v17.04,31.04
  Bottom 0.711: R2.1 0.91,34.3 v0.91,33.33
  Bottom 0.813: 10.16,34.8 IC1.4
  Bottom 1.27: IC1.2 IC1.4 | 7.37,34.29 X1.MT2 X1.MT1 C15.C
  other vias: 3.68,0.64 10.41,3.43 13.21,3.43 16.64,3.43 13.77,21.39 9.7,10.72 14.83,11 7.75,3.43 4.57,3.43 3.68,2.41 1.27,2.29 2.29,1.27
  pour $GND: 0,35.56 20.32,35.56 20.45,3.05 0.13,3.05
  pour Top (no thermals): 3.05,3.05 3.05,24.64 17.27,24.64 17.27,3.05
  pour Bottom (no thermals): 5.08,35.56 15.24,35.56 15.24,27.43 5.08,27.43
  pour Top (no thermals): 0,4.7 0,2.54 2.54,0 4.06,0 4.06,4.7
  pour $GND (no thermals): 0,4.7 0,2.54 2.54,0 4.06,0 4.06,4.7
LED1  (via drill 0.3)
  Top 0.203: v17.4,27.89 17.78,28.27 17.78,32.51 17.14,33.15 17.14,34.48 LED_USR.A
  Bottom 0.203: v17.4,27.89 17.15,27.64 RN1.4
LED2
  Bottom 0.203: U2.29 13.61,24.84 14.21,24.84 RN1.8
LED3
  Bottom 0.203: U2.30 13.85,24.36 13.87,24.38 15.14,24.38 15.47,24.72 RN1.7 15.34,25.1
LED4
  Bottom 0.203: U2.31 14.17,23.98 15.39,23.98 16.27,24.86 RN1.6
MEM_CS
  Bottom 0.203: U2.46 12.83,15.18 U3.1
  Bottom 0.305: U3.1 12.83,11.51 12.33,11.01 R9.1
N$1
  Top 0.305: X1.D+ 10.16,30.73 9.91,30.48 7.66,30.48 R5.2 7.62,30.44 7.62,31.75 7.11,32.26 6.1,32.26 5.55,31.71 R3.1
N$2
  Top 0.203: L1.2 X2.1
  Top 0.635: U1.RF_ANT 13.16,5.22 L1.2
N$3
  Top 0.635: ANT1.SIG | 6.1,5.08 6.1,1.05 ANT1.SIG | L1.1 6.1,5.08 | 6.1,5.08 C4.1
N$4
  cutout $GND: 7.52,32.19 arc-90 8.21,32.88 8.22,32.88 arc-91 8.9,32.19 arc-88 8.21,31.5 arc-92
N$6
  Top 0.305: X1.D- 10.81,30.72 11.05,30.48 12.66,30.48 R6.2
N$7
  Top 0.61: U1.SCL_CC3000 U1.SCL_EEPROM
N$8
  Bottom 0.305: Q1.2 4.7,30.38 4.52,30.2 3.15,30.2 2.92,29.97 2.92,27.81 3.17,27.56 R4.2
N$9
  Top 0.203: U1.WL_EN1 16.77,17.01 17.02,16.76 17.02,14.99 16.76,14.73 16.13,14.73 U1.WL_EN2
N$10  (via drill 0.3)
  Top 0.203: LED_RGB.1 9.26,26.79 9.53,27.05 13.23,27.05 13.59,26.7 v13.59,26.64
  Bottom 0.203: RN1.1 13.68,26.73 v13.59,26.64
N$11
  pour Top: 17.91,35.56 20.32,35.56 20.32,33.15 17.91,33.15
N$12  (via drill 0.3)
  Top 0.203: LED_RGB.3 11.06,27.93 11.18,27.81 13.89,27.81 v14.05,27.96
  Bottom 0.203: 14.07,27.94 v14.05,27.96 14.48,27.53 15.24,27.53 15.49,27.28 15.49,26.75 RN1.2
N$13
  Bottom 0.305: Q1.6 Q1.5 4.7,33.53 4.1,34.12 R1.1
  Bottom 0.406: R2.2 R1.1
N$14  (via drill 0.3)
  Top 0.203: LED_RGB.4 9.26,28.08 9.91,27.43 13.46,27.43 13.56,27.33 14.48,27.33 15.01,27.86 v15.01,28.17
  Bottom 0.203: RN1.3 16.26,26.75 16.26,27.28 15.37,28.17 v15.01,28.17
N$15
  Top 0.61: U1.SDA_EEPROM U1.SDA_CC3000
N$16  (via drill 0.3)
  Top 0.305: R3.2 3.47,32.05 2.85,32.05 v2.79,32.11
  Bottom 0.305: Q1.4 3.98,32.61 3.3,32.61 v2.79,32.11
N$17
  cutout $GND: 11.42,32.19 arc-90 12.11,32.88 12.12,32.88 arc-91 12.8,32.19 arc-88 12.11,31.5 arc-92
N$18
  cutout $+3V3: 7.52,32.19 arc-90 8.21,32.88 8.22,32.88 arc-91 8.9,32.19 arc-88 8.21,31.5 arc-92
N$19
  cutout $+3V3: 11.42,32.19 arc-90 12.11,32.88 12.12,32.88 arc-91 12.8,32.19 arc-88 12.11,31.5 arc-92
N$20
  cutout Bottom: 7.52,32.19 arc-90 8.21,32.88 8.22,32.88 arc-91 8.9,32.19 arc-88 8.21,31.5 arc-92
N$21
  cutout Bottom: 11.42,32.19 arc-90 12.11,32.88 12.12,32.88 arc-91 12.8,32.19 arc-88 12.11,31.5 arc-92
N$22
  cutout $+3V3: 6.82,34.85 arc-90 7.38,35.41 7.39,35.41 arc-90 7.95,34.85 7.95,33.76 7.95,33.73 arc-90 7.39,33.17 arc-90 6.82,33.74
  cutout $+3V3: 12.37,34.85 arc-90 12.93,35.41 12.94,35.41 arc-90 13.5,34.85 13.5,33.76 13.5,33.73 arc-90 12.94,33.17 arc-90 12.37,33.74
OSC32_IN
  Bottom 0.203: U2.3 7.57,15.25 7.57,14.88 8.33,14.12 8.33,12.27 8.43,12.17 8.77,12.17 Y1.X1 10.1,11.92 10.31,11.71 10.31,8.79 9.53,8 C9.1
OSC32_OUT
  Bottom 0.203: U2.4 7.14,15.53 7.14,14.71 7.75,14.1 7.75,9.42 | 7.75,9.42 7.75,7.33 C8.1 | Y1.X2 7.75,9.42
OSC_IN
  Bottom 0.203: U2.5 6.73,15.83 6.73,13.03 Y2.1 6.87,11.59 5.74,10.46 5.74,8.36 6.22,7.87 C11.1
OSC_OUT
  Bottom 0.203: U2.6 6.3,16.11 6.3,14.43 5.74,13.87 5.74,11.61 4.57,10.43 Y2.3 | 4.57,9.21 Y2.3 | Y2.3 C10.1
RAW  (via drill 0.3)
  Top 0.813: D1.CATHODE 3.05,33.98 1.27,32.21 JP1.1
  $+3V3 0.813: v14.25,32.03 13.51,31.29 9.35,31.29 8.23,30.18 6.04,30.18 4.67,31.55 4.67,32.46 3.76,33.38 2.44,33.38 1.27,32.21 JP1.1
  Bottom 0.813: IC1.1 12.47,30.4 12.98,30.91 C1.1 14.26,32.02 v14.25,32.03
RX  (via drill 0.3)
  $+3V3 0.203: v5.71,20.8 3.05,23.47 v3.05,24.31
  Bottom 0.203: U2.13 5.71,20.88 v5.71,20.8
  Bottom 0.305: JP1.4 2.87,24.13 v3.05,24.31
SPI_DOUT  (via drill 0.3)
  Top 0.203: U1.SPI_DOUT 11.73,22.23 11.73,21.84 11.28,21.39 10.77,21.39 10.21,20.83 v10.13,20.83
  $+3V3 0.203: v16.66,28.91 16.38,28.63 16.38,26.42 11.43,21.46 11.05,21.46 10.77,21.46 v10.13,20.83
  Bottom 0.203: U4.IN 16.36,29.21 v16.66,28.91
SPI_MISO  (via drill 0.3)
  $+3V3 0.305: v12.29,21.34 12.29,19.94 14.61,17.63 v14.61,14.66
  Bottom 0.203: v12.29,21.34 12.29,22.58 11.56,23.32 11.56,24.19 U2.27 12.55,25.18 12.55,25.7 12.9,26.06 12.9,26.87 13.41,27.38 13.41,28.5 13.62,28.71 U4.OUT
  Bottom 0.305: U3.2 14.1,14.15 v14.61,14.66 | v12.29,21.34 12.32,21.34
SPI_MOSI  (via drill 0.3)
  Top 0.203: 9.37,22.27 9.37,21.92 8.99,21.54 8.53,21.54 8.31,21.31 8.31,20.37 8.61,20.07 9.37,20.07 v9.91,19.53
  Top 0.305: U1.SPI_DIN 9.37,22.27
  $+3V3 0.305: v14.43,9.27 8.89,14.81 8.89,18.52 v9.91,19.53
  Bottom 0.203: U2.28 11.99,23.92 11.99,23.57 12.98,22.58 12.98,21.08 11.43,19.53 v9.91,19.53
  Bottom 0.305: U3.5 16.64,7.06 v14.43,9.27
SPI_SCK  (via drill 0.3)
  Top 0.305: U1.SPI_CLK 7.16,21.36 v7.7,20.83
  $+3V3 0.305: v13.18,9.45 8.26,14.38 8.26,19.66 7.7,20.22 v7.7,20.83
  Bottom 0.203: U2.26 11.12,24.47 11.12,23.14 11.63,22.63 11.63,20.24 11.33,19.94 10.49,19.94 10.26,20.17 8.36,20.17 v7.7,20.83
  Bottom 0.305: U3.6 15.37,7.26 v13.18,9.45
TX  (via drill 0.3)
  $+3V3 0.203: v2.79,25.55 2.44,25.2 2.44,22.63 5.56,19.51 v6.15,19.51
  Bottom 0.203: U2.12 5.51,19.56 6.1,19.56 v6.15,19.51
  Bottom 0.305: v2.79,25.55 1.68,26.67 JP1.3
USB_DISC
  Bottom 0.203: U2.21 7.26,24.98 7.26,25.73 6.93,26.06 5.7,26.06 R7.2 R4.1
USBM  (via drill 0.3)
  Top 0.203: 12.94,28.73 R6.1 arc-90 13.04,28.83 13.07,28.8 15.39,28.8 15.7,28.5 15.7,28.12 16.79,27.03 16.79,25.7 16.33,25.25 v16.33,23.98
  Bottom 0.203: U2.32 14.47,23.57 15.93,23.57 v16.33,23.98
USBP  (via drill 0.3)
  Top 0.203: 7.42,28.54 R5.1 8.38,29.5 8.38,29.84 8.51,29.97 11.68,29.97 12.19,29.46 13.59,29.46 13.89,29.16 15.6,29.16 16.05,28.7 16.05,28.3 17.2,27.15 v17.2,24.26
  Bottom 0.203: U2.33 14.77,23.16 16.76,23.16 17.2,23.6 v17.2,24.26
UVCC  (via drill 0.3)
  Top 0.305: X1.VBUS 11.44,31.61 arc-90 11.43,31.62 11.68,31.37
  Top 0.61: D1.ANODE 5.59,34.04 6.22,33.4 v6.22,33.15 | 11.68,31.37 12.57,31.37 13.21,32 v13.21,32.51
  $+3V3 0.61: v6.22,33.15 arc90 6.6,32.77 7.14,32.77 arc37 7.67,32.94 arc-50 8.53,33.12 12.01,33.12 arc-54 v13.21,32.51
  Bottom 0.61: R1.2 5.8,34.08 6.22,33.66 v6.22,33.15
VDDA  (via drill 0.3)
  $+3V3 0.305: v13.18,20.3 13.08,20.4 13.08,21.84 17.91,26.67 JP2.3
  $+3V3 0.508: v16.33,33.38 16.33,32.92 17.88,31.37 17.88,28.65 19.05,27.48 JP2.3
  Bottom 0.203: C13.1 5.41,16.93 5.41,17.34 U2.9 6.92,18.85 12.34,18.85 13.21,19.71 13.21,20.27 v13.18,20.3
  Bottom 0.61: L2.2 15.41,32.45 v16.33,33.38 17.2,34.24 17.73,34.24
  Bottom 0.762: 17.8,34.27 C15.A
  Bottom 0.813: 17.73,34.24 C15.A
WIFI_CS  (via drill 0.3)
  Top 0.203: U1.SPI_CS 12.91,22.7
  Top 0.305: v10.97,20.55 12.47,20.55 13.03,21.11 13.03,22.33 U1.SPI_CS
  $+3V3 0.203: v10.97,20.55 10.59,20.17 9.93,20.17 9.53,20.57 9.53,21.18 10.31,21.97 11.3,21.97 15.88,26.54 15.88,29.34 16.26,29.72 v17.07,29.72
  Bottom 0.203: U2.25 10.69,24.74 10.69,22.96 10.97,22.68 v10.97,20.55 | U4./OE v17.06,29.71 v17.07,29.72
WIFI_EN  (via drill 0.3)
  Top 0.203: 4.33,12.19 U1.VBAT_SW_EN
  Top 0.305: U1.VBAT_SW_EN 5.33,12.21 6.53,13.41 9.5,13.41 10.41,14.33 10.41,16.76 v10.67,17.02
  Bottom 0.203: U2.45 12.13,16.59 11.1,16.59 v10.67,17.02
WIFI_INT  (via drill 0.3)
  Top 0.203: U1.SPI_IRQ 10.76,22.14 10.52,21.89 10.52,21.79 10.21,21.49 9.65,21.49 9.02,20.85 v8.91,20.85
  Bottom 0.203: U2.22 8.72,24.23 8.74,24.23 9.09,23.88 9.09,21.03 v8.91,20.85

### Text on the board
tPlace: 3V3 | VIN | RST | GND | 3V3 | TX | BTN | RST | GND | RX | D7 | A7 | D6 | A6 | D5 | A5 | D4 | A4 | D3 | A3 | D2 | A2 | D1 | A1 | D0 | A0
tDocu: Reference Designs ARE PROVIDED "AS IS" AND "WITH ALL FAULTS. SPARK LABS, INC / ("SPARK") DISCLAIMS ALL OTHER WARRANTIES, EXPRESS OR IMPLIED, REGARDING / PRODUCTS OR THE REFERENCE DESIGNS, INCLUDING BUT NOT LIMITED TO, ANY / IMPLIED WARRANTIES OF MERCHANTABILITY, FITNESS FOR A PARTICULAR PURPOSE, / OR NON-INFRINGEMENT. / / Spark may make changes to specifications and product descriptions at any / time, without notice. The Customer must not rely on the absence or / characteristics of any features or instructions marked "reserved" or / "undefined." Spark reserves these for future definition and shall have / no responsibility whatsoever for conflicts or incompatibilities arising / from future changes to them. The product information on the Web Site or / Materials is subject to change without notice. Do not finalize a design / with this information. / Spark is a registered trademark.